# Altium schematic sheet GPS track2.SchDoc: GPS Tracker APRS based
size A3; CheckedBy: I.Ivanov; Author: I.Ivanov; DrawnBy: Eng. I.Ivanov; Engineer: Eng. I.Ivanov; Organization: TU-Sofia; Revision: 2; SheetNumber: 1; SheetTotal: 3; PageSetup: Record=PageOptions|CenterHorizontal=True|CenterVertical=True|PrintScale=1.04|XCorrection=1.00|YCorrection=1.00|PrintKind=2|BorderSize=5000000|LeftOffset=0|BottomOffset=0|Orientation=2|PaperLength=1000|PaperWidth=1000|Scale=100|PaperSource=15|PrintQuality=3600|MediaType=1|DitherType=10|PaperKind=A3|PrintScaleMode=1; ProjectName: GPS Tracker
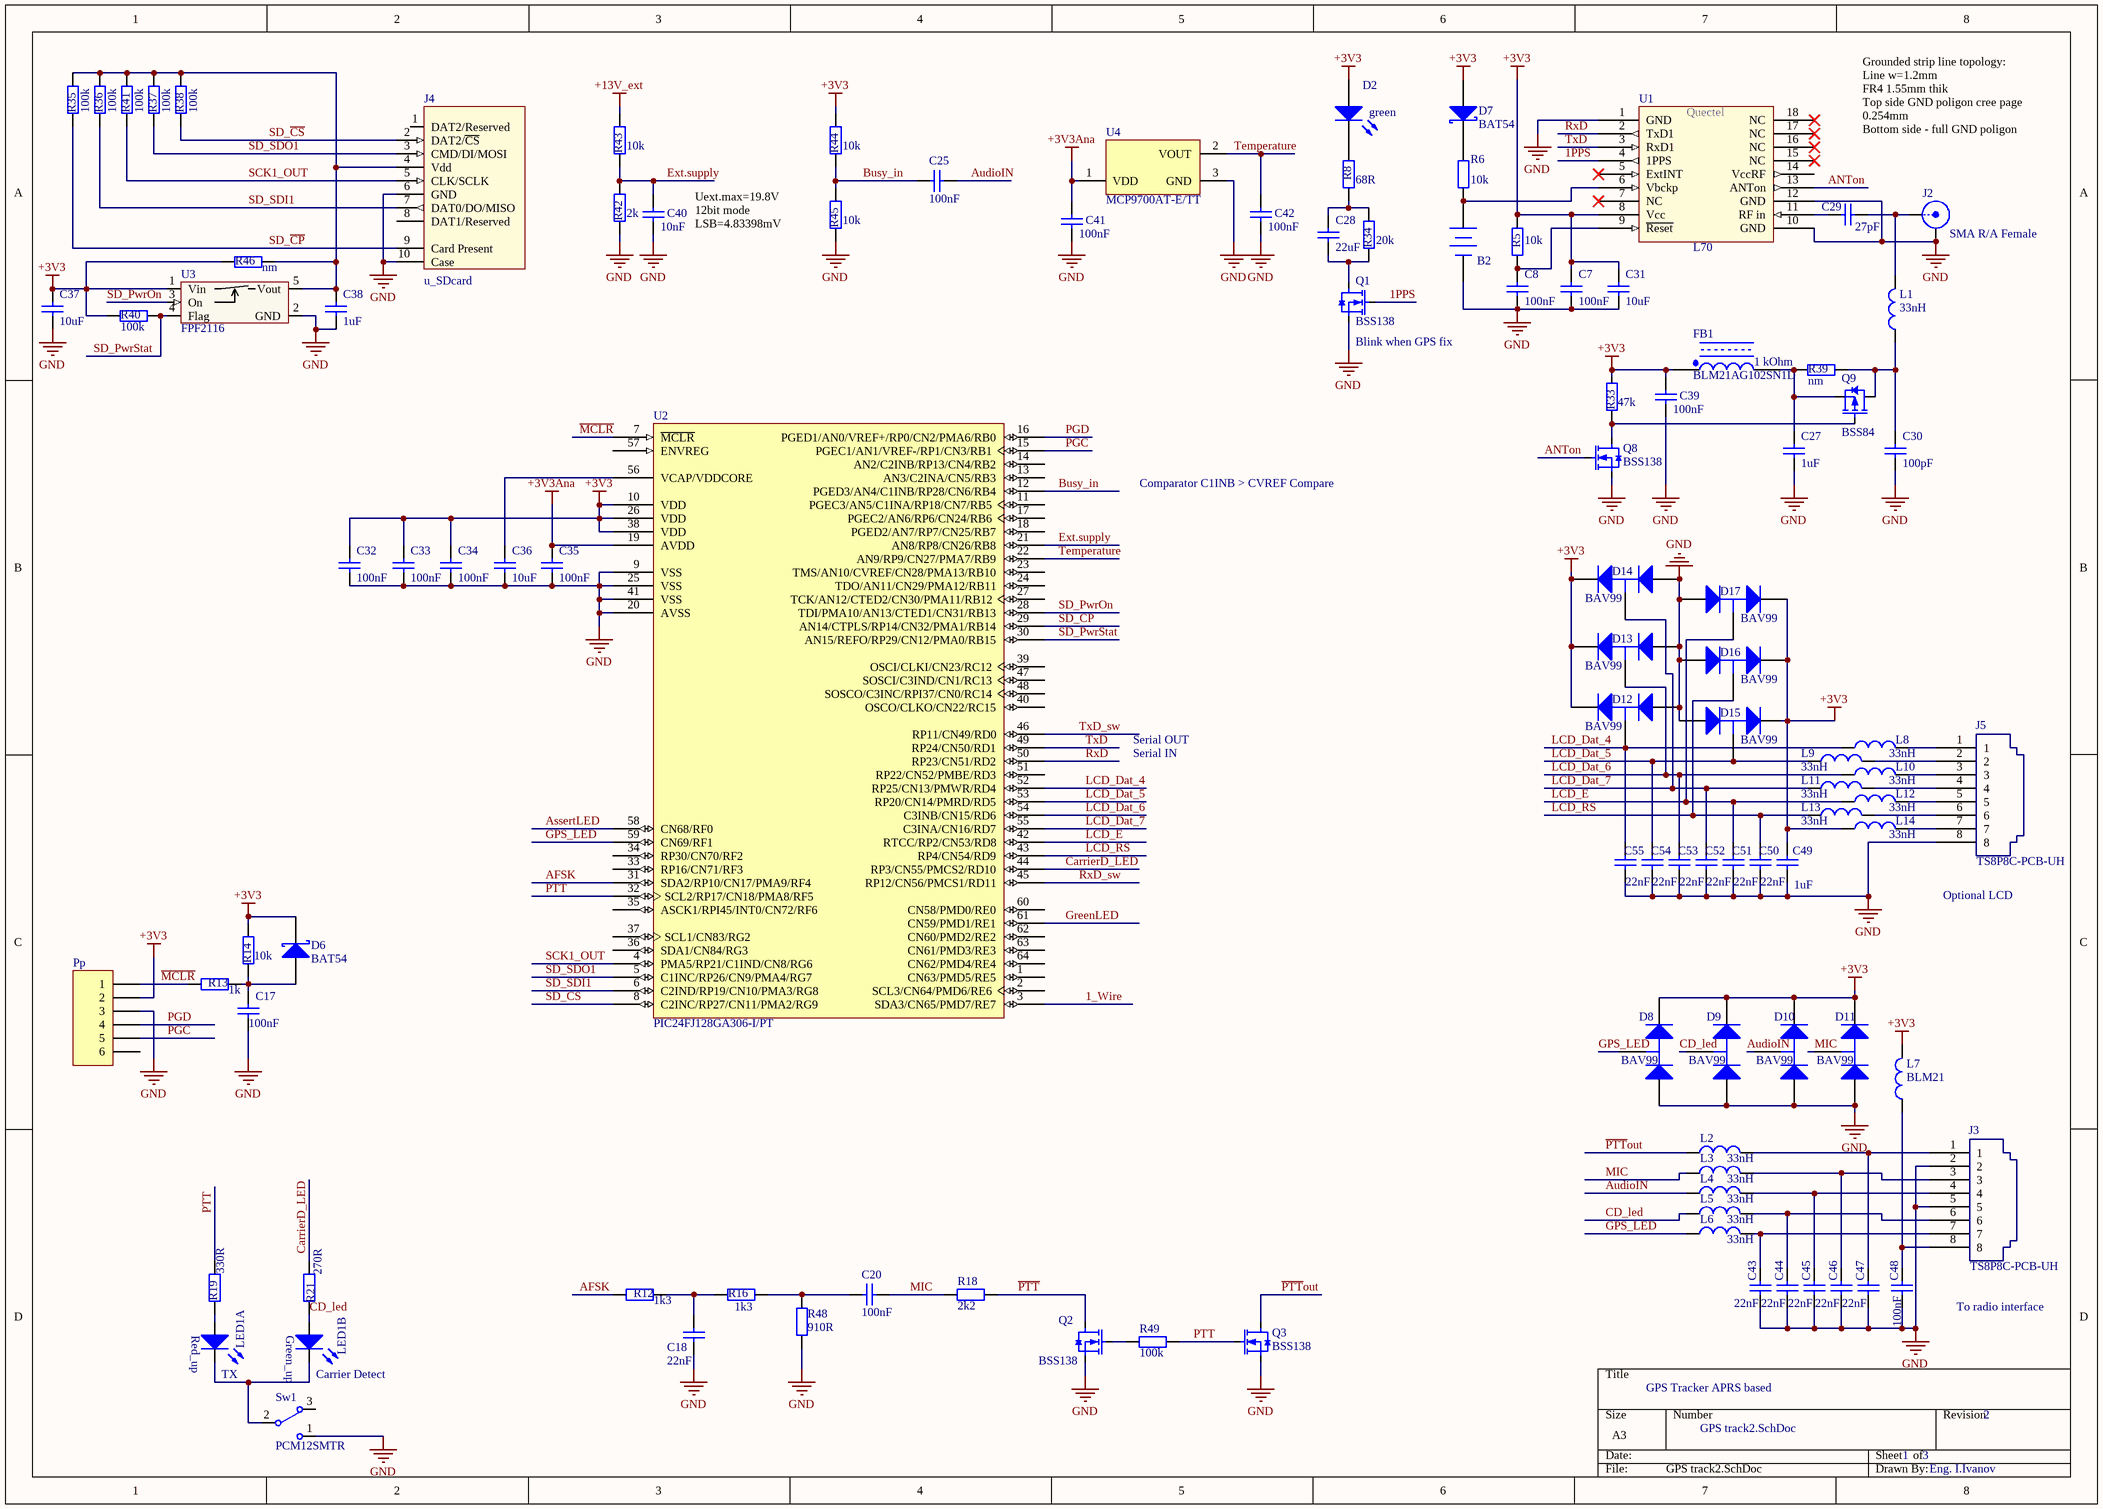
[diagram p0: GPS track2.SchDoc]

## Parts
B2  CR2032 holder  [1065 Keystone]  (value not drawn)
C7  value 100nF  [2012[0805]]  (hidden comment: Cap Semi)
C8  value 100nF  [2012[0805]]  (hidden comment: Cap Semi)
C17  value 100nF  [2012[0805]]  (hidden comment: Cap Semi)
C18  value 22nF  [2012[0805]]  (hidden comment: Cap Semi)
C20  value 100nF  [2012[0805]]  (hidden comment: Cap Semi)
C25  value 100nF  [C0805]  (hidden comment: Cap Semi)
C27  value 1uF  [C0805]  (hidden comment: Cap Semi)
C28  value 22uF  [C0805]  (hidden comment: Cap Semi)
C29  value 27pF  [C0805]  (hidden comment: Cap Semi)
C30  value 100pF  [C0805]  (hidden comment: Cap Semi)
C31  value 10uF  [C0805]  (hidden comment: Cap Semi)
C32  value 100nF  [2012[0805]]  (hidden comment: Cap Semi)
C33  value 100nF  [2012[0805]]  (hidden comment: Cap Semi)
C34  value 100nF  [2012[0805]]  (hidden comment: Cap Semi)
C35  value 100nF  [2012[0805]]
C36  value 10uF  [2012[0805]]  (hidden comment: Cap Semi)
C37  value 10uF  [2012[0805]]  (hidden comment: Cap Semi)
C38  value 1uF  [2012[0805]]  (hidden comment: Cap Semi)
C39  value 100nF  [C0805]  (hidden comment: Cap Semi)
C40  value 10nF  [C0805]  (hidden comment: Cap Semi)
C41  value 100nF  [C0805]  (hidden comment: Cap Semi)
C42  value 100nF  [C0805]  (hidden comment: Cap Semi)
C43  value 22nF  [C0805]  (hidden comment: Cap Semi)
C44  value 22nF  [C0805]  (hidden comment: Cap Semi)
C45  value 22nF  [C0805]  (hidden comment: Cap Semi)
C46  value 22nF  [C0805]  (hidden comment: Cap Semi)
C47  value 22nF  [C0805]  (hidden comment: Cap Semi)
C48  value 100nF  [C0805]  (hidden comment: Cap Semi)
C49  value 1uF  [C0805]  (hidden comment: Cap Semi)
C50  value 22nF  [C0805]  (hidden comment: Cap Semi)
C51  value 22nF  [C0805]  (hidden comment: Cap Semi)
C52  value 22nF  [C0805]  (hidden comment: Cap Semi)
C53  value 22nF  [C0805]  (hidden comment: Cap Semi)
C54  value 22nF  [C0805]  (hidden comment: Cap Semi)
C55  value 22nF  [C0805]  (hidden comment: Cap Semi)
D2  OSTG1206C1A  [3.2X1.6X1.1]  (value not drawn)
D6  BAT54  [SOT23_N]
D7  BAT54  [SOT23_N]
D8  BAV99  [SOT-23]
D9  BAV99  [SOT-23]
D10  BAV99  [SOT-23]
D11  BAV99  [SOT-23]
D12  BAV99  [SOT-23]
D13  BAV99  [SOT-23]
D14  BAV99  [SOT-23]
D15  BAV99  [SOT-23]
D16  BAV99  [SOT-23]
D17  BAV99  [SOT-23]
FB1  BLM21AG102SN1D  value 1 kOhm  [RESC2012N]
J2  value SMA R/A Female  [SMA R/A PCB]  (hidden comment: SMA R/A PCB)
J3  TS8P8C-PCB-UH  [TS8P8C-PCB-UH]
J4  value u_SDcard  [112A-TAAR-R02]  (hidden comment: microSD Socket)
J5  TS8P8C-PCB-UH  [TS8P8C-PCB-UH]
L1  value 33nH  [CCFH0805 C Series]  (hidden comment: CCFH 0805 series choke)
L2  value 33nH  [CCFH0805 C Series]  (hidden comment: CCFH 0805 series choke)
L3  value 33nH  [CCFH0805 C Series]  (hidden comment: CCFH 0805 series choke)
L4  value 33nH  [CCFH0805 C Series]  (hidden comment: CCFH 0805 series choke)
L5  value 33nH  [CCFH0805 C Series]  (hidden comment: CCFH 0805 series choke)
L6  value 33nH  [CCFH0805 C Series]  (hidden comment: CCFH 0805 series choke)
L7  value BLM21  [CCFH0805 C Series]  (hidden comment: CCFH 0805 series choke)
L8  value 33nH  [CCFH0805 C Series]  (hidden comment: CCFH 0805 series choke)
L9  value 33nH  [CCFH0805 C Series]  (hidden comment: CCFH 0805 series choke)
L10  value 33nH  [CCFH0805 C Series]  (hidden comment: CCFH 0805 series choke)
L11  value 33nH  [CCFH0805 C Series]  (hidden comment: CCFH 0805 series choke)
L12  value 33nH  [CCFH0805 C Series]  (hidden comment: CCFH 0805 series choke)
L13  value 33nH  [CCFH0805 C Series]  (hidden comment: CCFH 0805 series choke)
L14  value 33nH  [CCFH0805 C Series]  (hidden comment: CCFH 0805 series choke)
LED1  4x LED's  [515-1061F_2x dual LED's]  (value not drawn)  (parts A,B of 4)
Pp  Header 6  [HDR1X6]  (value not drawn)
Q1  value BSS138  [SOT-23_my]  (hidden comment: My BSS138)
Q2  value BSS138  [SOT-23_my]  (hidden comment: My BSS138)
Q3  value BSS138  [SOT-23_my]  (hidden comment: My BSS138)
Q8  value BSS138  [SOT-23_my]  (hidden comment: My BSS138)
Q9  value BSS84  [SOT-23_my]  (hidden comment: My SOT23 BSS84)
R5  value 10k  [2012[0805]]  (hidden comment: Res2)
R6  value 10k  [2012[0805]]  (hidden comment: Res2)
R8  value 68R  [2012[0805]]  (hidden comment: Res2)
R12  value 1k3  [RESC2012N]  (hidden comment: Res2)
R13  value 1k  [RESC2012N]  (hidden comment: Res2)
R14  value 10k  [2012[0805]]  (hidden comment: Res2)
R16  value 1k3  [RESC2012N]  (hidden comment: Res2)
R18  value 2k2  [2012[0805]]  (hidden comment: Res2)
R19  value 330R  [2012[0805]]  (hidden comment: Res2)
R21  value 270R  [2012[0805]]  (hidden comment: Res2)
R33  value 47k  [2012[0805]]  (hidden comment: Res2)
R34  value 20k  [2012[0805]]  (hidden comment: Res2)
R35  value 100k  [2012[0805]]  (hidden comment: Res2)
R36  value 100k  [2012[0805]]  (hidden comment: Res2)
R37  value 100k  [2012[0805]]  (hidden comment: Res2)
R38  value 100k  [2012[0805]]  (hidden comment: Res2)
R39  value nm  [2012[0805]]  (hidden comment: Res2)
R40  value 100k  [2012[0805]]  (hidden comment: Res2)
R41  value 100k  [2012[0805]]  (hidden comment: Res2)
R42  value 2k  [2012[0805]]  (hidden comment: Res2)
R43  value 10k  [2012[0805]]  (hidden comment: Res2)
R44  value 10k  [2012[0805]]  (hidden comment: Res2)
R45  value 10k  [2012[0805]]  (hidden comment: Res2)
R46  value nm  [2012[0805]]  (hidden comment: Res2)
R48  value 910R  [2012[0805]]  (hidden comment: Res2)
R49  value 100k  [2012[0805]]  (hidden comment: Res2)
Sw1  value PCM12SMTR  [PCM12SMTR]  (hidden comment: SPDT)
U1  value L70  Manufacturer: Quectel  [L70]  (hidden comment: L70 Quectel)
U2  PIC24FJ128GA306-I/PT  [TQFP-PT64_N]
U3  value FPF2116  [SOT23-5AN]  (hidden comment: IntelliMAX™ Advanced Load Management)
U4  MCP9700AT-E/TT  [SOT-23-TT3_N]

## Nets
+3V3: C7.2 C31.1 C32.2 C33.2 C34.2 C37.2 C39.1 C49.1 D2.1(A) D6.3(K) D7.1(A) D8.2(K) D9.2(K) D10.2(K) D11.2(K) D12.2(K) D13.2(K) D14.2(K) D15.2(K) D16.2(K) D17.2(K) FB1.1 L7.2 L14.1 Pp.2 R5.2 R14.1 R33.1 R40.1 R44.1 R46.1 U1.8(Vcc) U2.10(VDD) U2.26(VDD) U2.38(VDD) U3.1(Vin)
+3V3Ana: C35.2 C41.1 U2.19(AVDD) U4.1(VDD)
+13V_ext: R43.1
GND: B2.2(-) C7.1 C8.1 C17.1 C18.1 C27.1 C30.2 C31.2 C32.1 C33.1 C34.1 C35.1 C36.1 C37.1 C38.1 C39.2 C40.2 C41.2 C42.2 C43.2 C44.2 C45.2 C46.2 C47.2 C48.2 C49.2 C50.2 C51.2 C52.2 C53.2 C54.2 C55.2 D8.1(A) D9.1(A) D10.1(A) D11.1(A) D12.1(A) D13.1(A) D14.1(A) D15.1(A) D16.1(A) D17.1(A) J2.2(Y) J3.2 J3.5 J4.6(GND) J4.10(Case) J5.8 Pp.3 Q1.2(S) Q2.2(S) Q3.2(S) Q8.2(S) R42.2 R45.2 R48.1 Sw1.1 U1.1(GND) U1.10(GND) U1.12(GND) U2.9(VSS) U2.20(AVSS) U2.25(VSS) U2.41(VSS) U3.2(GND) U4.3(GND)
1_Wire: U2.3(SDA3/CN65/PMD7/RE7)
1PPS: Q1.1(G) U1.4(1PPS)
AFSK: R12.2 U2.31(SDA2/RP10/CN17/PMA9/RF4)
ANTon: Q8.1(G) U1.13(ANTon)
AssertLED: U2.58(CN68/RF0)
AudioIN: C25.2 D10.3(C) L4.1
Busy_in: C25.1 R44.2 R45.1 U2.12(PGED3/AN4/C1INB/RP28/CN6/RB4)
CarrierD_LED: R21.1 U2.44(RP3/CN55/PMCS2/RD10)
CD_led: D9.3(C) L5.1 LED1.4u(A) R21.2
Ext.supply: C40.1 R42.1 R43.2 U2.21(AN8/RP8/CN26/RB8)
GPS_LED: D8.3(C) L6.1 U2.59(CN69/RF1)
GreenLED: U2.61(CN59/PMD1/RE1)
LCD_Dat_4: C55.1 D12.3(C) L8.1 U2.52(RP25/CN13/PMWR/RD4)
LCD_Dat_5: C54.1 D15.3(C) L9.1 U2.53(RP20/CN14/PMRD/RD5)
LCD_Dat_6: C53.1 D13.3(C) L10.1 U2.54(C3INB/CN15/RD6)
LCD_Dat_7: C52.1 D14.3(C) L11.1 U2.55(C3INA/CN16/RD7)
LCD_E: C51.1 D17.3(C) L12.1 U2.42(RTCC/RP2/CN53/RD8)
LCD_RS: C50.1 D16.3(C) L13.1 U2.43(RP4/CN54/RD9)
~{MCLR}: Pp.1 R13.2 U2.7(~{MCLR})
MIC: C20.1 D11.3(C) L3.1 R18.2
~{PTT}: Q2.3(D) R18.1
~{PTT}out: L2.1 Q3.3(D)
PGC: Pp.5 U2.15(PGEC1/AN1/VREF-/RP1/CN3/RB1)
PGD: Pp.4 U2.16(PGED1/AN0/VREF+/RP0/CN2/PMA6/RB0)
PTT: Q3.1(G) R19.1 R49.2 U2.32(SCL2/RP17/CN18/PMA8/RF5)
RxD: U1.2(TxD1) U2.50(RP23/CN51/RD2)
RxD_sw: U2.45(RP12/CN56/PMCS1/RD11)
SCK1_OUT: J4.5(CLK/SCLK) R41.1 U2.4(PMA5/RP21/C1IND/CN8/RG6)
SD_~{CP}: J4.9(Card_Present) R35.2 U2.29(AN14/CTPLS/RP14/CN32/PMA1/RB14)
SD_~{CS}: J4.2(DAT2/~{CS}) R38.2 U2.8(C2INC/RP27/CN11/PMA2/RG9)
SD_PwrOn: U2.28(TDI/PMA10/AN13/CTED1/CN31/RB13) U3.3(On)
SD_PwrStat: R40.2 U2.30(AN15/REFO/RP29/CN12/PMA0/RB15) U3.4(Flag)
SD_SDI1: J4.7(DAT0/DO/MISO) R36.2 U2.6(C2IND/RP19/CN10/PMA3/RG8)
SD_SDO1: J4.3(CMD/DI/MOSI) R37.2 U2.5(C1INC/RP26/CN9/PMA4/RG7)
Temperature: C42.1 U2.22(AN9/RP9/CN27/PMA7/RB9) U4.2(VOUT)
TxD: U1.3(RxD1) U2.49(RP24/CN50/RD1)
TxD_sw: U2.46(RP11/CN49/RD0)
NetB2_1: B2.1(+) R6.1 U1.6(Vbckp)
NetC8_2: C8.2 R5.1 U1.9(~{Reset})
NetC17_2: C17.2 D6.1(A) R13.1 R14.2
NetC18_2: C18.2 R12.1 R16.2
NetC20_2: C20.2 R16.1 R48.2
NetC27_2: C27.2 FB1.2 Q9.2(S) R39.1
NetC28_1: C28.1 Q1.3(D) R34.2
NetC28_2: C28.2 R8.1 R34.1
NetC29_1: C29.1 J2.1(X) L1.2
NetC29_2: C29.2 U1.11(RF_in)
NetC30_1: C30.1 L1.1 Q9.3(D) R39.2
NetC36_2: C36.2 U2.56(VCAP/VDDCORE)
NetC38_2: C38.2 J4.4(Vdd) R35.1 R36.1 R37.1 R38.1 R41.2 R46.2 U3.5(Vout)
NetC43_1: C43.1 J3.7 L6.2
NetC44_1: C44.1 J3.6 L5.2
NetC45_1: C45.1 J3.4 L4.2
NetC46_1: C46.1 J3.3 L3.2
NetC47_1: C47.1 J3.1 L2.2
NetC48_1: C48.1 J3.8 L7.1
NetD2_2: D2.2(K) R8.2
NetD7_3: D7.3(K) R6.2
NetJ5_1: J5.1 L8.2
NetJ5_2: J5.2 L9.2
NetJ5_3: J5.3 L10.2
NetJ5_4: J5.4 L11.2
NetJ5_5: J5.5 L12.2
NetJ5_6: J5.6 L13.2
NetJ5_7: J5.7 L14.2
NetLED1_1u: LED1.1u(K) LED1.3u(K) Sw1.2
NetLED1_2u: LED1.2u(A) R19.2
NetQ2_1: Q2.1(G) R49.1
NetQ8_3: Q8.3(D) Q9.1(G) R33.2

Not connected (* = marked no-connect by the designer): J4 1(DAT2/Reserved) 8(DAT1/Reserved); Pp 6; Sw1 3; U1 5(ExtINT)* 7(NC)* 14(VccRF) 15(NC)* 16(NC)* 17(NC)* 18(NC)*; U2 1(CN63/PMD5/RE5) 2(SCL3/CN64/PMD6/RE6) 11(PGEC3/AN5/C1INA/RP18/CN7/RB5) 13(AN3/C2INA/CN5/RB3) 14(AN2/C2INB/RP13/CN4/RB2) 17(PGEC2/AN6/RP6/CN24/RB6) 18(PGED2/AN7/RP7/CN25/RB7) 23(TMS/AN10/CVREF/CN28/PMA13/RB10) 24(TDO/AN11/CN29/PMA12/RB11) 27(TCK/AN12/CTED2/CN30/PMA11/RB12) 33(RP16/CN71/RF3) 34(RP30/CN70/RF2) 35(ASCK1/RPI45/INT0/CN72/RF6) 36(SDA1/CN84/RG3) 37(SCL1/CN83/RG2) 39(OSCI/CLKI/CN23/RC12) 40(OSCO/CLKO/CN22/RC15) 47(SOSCI/C3IND/CN1/RC13) 48(SOSCO/C3INC/RPI37/CN0/RC14) 51(RP22/CN52/PMBE/RD3) 57(ENVREG) 60(CN58/PMD0/RE0) 62(CN60/PMD2/RE2) 63(CN61/PMD3/RE3) 64(CN62/PMD4/RE4)

## Notes on the sheet
- (near D2) green
- Grounded strip line topology:
  Line w=1.2mm
  FR4 1.55mm thik
  Top side GND poligon cree page 0.254mm
  Bottom side - full GND poligon
- Uext.max=19.8V
  12bit mode
  LSB=4.83398mV
- (near Q1) Blink when GPS fix
- Comparator C1INB > CVREF Compare
- Serial IN
- Serial OUT
- (near J5) Optional LCD
- To radio interface
- (near LED1) TX
- Carrier Detect
- (in symbol 515-1061F_2x dual LED's, part A) Red_up
- (in symbol 515-1061F_2x dual LED's, part B) Green_up

## Library data of the parts
B2 = CR2032_holder: Value: Keystone 103; Details: CR2032 battery holder TH; Option: 103 - horizontal; 1065 vertical; Created by: Charge; Value 2: Keystone 1065
C7 C17 C18 C20 C25 C27-C55 = Cap Semi: Capacitor (Semiconductor SIM Model); Published: 8-Jun-2000; LatestRevisionDate: 17-Jul-2002; LatestRevisionNote: Re-released for DXP Platform.; Publisher: Altium Limited
  C7 C17 C18 C20 C25 C27-C40 C42-C55: PackageReference: C1206
D2 = HSMM-C150: High Performance SMT Chip LED, Green; LuminousIntensity: 40mcd (Minimum).; PCB_Layout: Complies with manufacturer's recommendation.; Published: 11-Dec-2002; DatasheetDocument: 11-Mar-2002; PackageDocument: 26-Feb-2002; PackageReference: 3.2X1.6X1.1; Publisher: Altium Limited; LED_Colour: Green; ComponentLink1Description: Manufacturer Link; ComponentLink1URL: http://www.agilent.com/; ComponentLink2Description: Datasheet; ComponentLink2URL: http://cp.literature.agilent.com/litweb/pdf/5988-5213EN.pdf
D6 D7 = BAT54: Schottky Barrier Diode; Note: Pin 2 is not connected and is not drawn; Published: 17-Sep-2003; LatestRevisionDate: 12-Dec-2006; LatestRevisionNote: IPC-7351 Footprint Added.; DatasheetVersion: 4-Mar-2002; PackageVersion: May-1999; PackageReference: SOT23; Publisher: Altium Limited; PackageDescription: 3-Pin SOT-23 Package 0.95 mm Pitch, 2.3 mm Lead Span; ComponentLink1Description: Manufacturer Link; ComponentLink1URL: http://www.semiconductors.philips.com/; ComponentLink2Description: Datasheet; ComponentLink2URL: http://www.semiconductors.philips.com/acrobat/datasheets/BAT54_SERIES_4.pdf
D8-D17 = BAV99: Silicon Switching Diode Array for High-Speed Switching; Published: 21-Mar-2003; DatasheetDocument: Oct-1999; PackageDocument: Sep-2001; PackageReference: SOT-23; Publisher: Altium Limited; ComponentLink1Description: Manufacturer Link; ComponentLink1URL: http://www.infineon.com/; ComponentLink2Description: Datasheet; ComponentLink2URL: http://www.infineon.com/upload/Document/cmc_upload/documents/080/631/bav99series_1.pdf
FB1 = Inductor Isolated: Isolated Inductor; PackageDocument: 1988; Published: 24-Mar-1999; LatestRevisionDate: 17-Jul-2002; LatestRevisionNote: Re-released for DXP Platform.; PackageReference: 425; Publisher: Altium Limited
J3 J5 = TS8P8C-PCB-UH: Description: Cvilux - CJ3188A1100; Supplier: Comet; Value: TS8P8C-PCB-UH
J4 = Micro SD Socket PP T1: Manufacturer: Attend Technology; Supplier: Comet; Order Code: Micro SD Socket PP T1
L1-L14 = CCFH0805 coil Coils: SRF: Self resonance frequency = 375MHz; Supplier: Comet; Datasheet: http://home.comet.bg/datasheets/Coils/CCFH0805 C Series.pdf; Price: 0.10 Euro
LED1 = 515-1061F_2x dual LED's: Light pipe manufacturer: Dialight; LED's type: 3x2.5mm leadless, dual, 4 pins; Example LED's 1: SML020 (Rohm); Example LED's 1: 597-77x1-5xx (Dialight); Light pipe: 515-1061F
Pp = Header 6: Header, 6-Pin; LatestRevisionDate: 17-Jul-2002; LatestRevisionNote: Re-released for DXP Platform.; Publisher: Altium Limited
Q1-Q3 Q8 = BSS138_my
Q9 = BSS84_my: Manufacturer: Zetex; Rohm, etc; PackageDescription: SOT-23; 3 Leads; Body 3.1 x 2.5 mm, inc. leads (LxW max), Alternate Lead Configuration
R5 R6 R8 R12-R14 R16 R18 R19 R21 R33-R46 R48 R49 = Res2: Resistor; Published: 8-Jun-2000; LatestRevisionDate: 17-Jul-2002; LatestRevisionNote: Re-released for DXP Platform.; PackageReference: AXIAL-0.4; Publisher: Altium Limited
Sw1 = PCM12SMTR: Ultraminiature Surface Mount Slide Switch; Manufacturer: C & K COMPONENTS; Max Voltage: 6V @ 0.3A; Order Code: 9575146; Series: C&K PCM Series; Switch configuration: SPDT; Supplier: Farnell; Price: 1.24 ˆ
U1 = L70 Quectel: Chipset: MT3339
U2 = PIC24FJ128GA106-I/PT: General Purpose 16-Bit Flash Microcontroller, 128KB Flash, 16KB SRAM, 64-Pin TQFP, Industrial Temperature; FirstPublished: 29-Jan-2009; LatestRevisionDate: 02-Dec-2009; LatestRevisionNote: Updated schematic according to current datasheet revision.; DatasheetVersion: revC, Apr-2009; PackageVersion: revBB, Aug-2009; PackageReference: TQFP-PT64; Publisher: Altium Limited; PackageDescription: 64-Lead Thin Plastic Quad Flat Pack (PT) - 10x10x1mm Body, 2.00mm [TQFP]; Supplier 1: Digi-Key; Supplier Part Number 1: PIC24FJ128GA106-I/PT-ND; Supplier 2: Farnell; Supplier Part Number 2: 1576845; Supplier 3: Newark; Supplier Part Number 3: 54M5089; Code_JEDEC: MS-026; ComponentLink1Description: Datasheet; ComponentLink1URL: http://ww1.microchip.com/downloads/en/DeviceDoc/39905c.pdf; ComponentLink2Description: Packaging Specification; ComponentLink2URL: http://www.microchip.com/stellent/groups/techpub_sg/documents/packagingspec/en012702.pdf; ComponentLink3Description: Microchip.com Home; ComponentLink3URL: http://www.microchip.com/
U3 = FPF2116: Load Switch, current limited, status output; Manufacturer: Fairchild Semiconductor; Description: IntelliMAX™ Advanced Load Management Switch; Voltage range: 1.8V to 5.5V Input; Over current limit: 200mA typical; On input: active high => switch is on; Order Code: 1716991; Supplier: Farnell; Price: ˆ0.53
U4 = MCP9700AT-E/TT: Low-Power Linear Active Thermistor IC, 3-Pin SOT-23, Extended Temperature, Tape and Reel; FirstPublished: 29-Jan-2009; LatestRevisionDate: 02-Dec-2009; LatestRevisionNote: Updated datasheet to version revE, Apr-2009.; DatasheetVersion: revE, Apr-2009; PackageVersion: revBB, Aug-2009; PackageReference: SOT-23-TT3; Publisher: Altium Limited; PackageDescription: 3-Lead Plastic Small Outline Transistor (TT) [SOT-23]; Supplier 1: Digi-Key; Supplier Part Number 1: MCP9700AT-E/TTTR-ND; Supplier 2: Farnell; Supplier Part Number 2: 1605577; Supplier 3: Newark; Supplier Part Number 3: 17M0677; Code_IPC: SOT23-3; ComponentLink1Description: Datasheet; ComponentLink1URL: http://ww1.microchip.com/downloads/en/DeviceDoc/21942e.pdf; ComponentLink2Description: Packaging Specification; ComponentLink2URL: http://www.microchip.com/stellent/groups/techpub_sg/documents/packagingspec/en012702.pdf; ComponentLink3Description: Microchip.com Home; ComponentLink3URL: http://www.microchip.com/
C8 = Cap Semi: Published: 8-Jun-2000; LatestRevisionDate: 17-Jul-2002; LatestRevisionNote: Re-released for DXP Platform.; Publisher: Altium Limited
J2 = SMA R/A PCB: Created by: Charge